# Altium schematic sheet LMR514203.3V.SchDoc
size A; SheetNumber: 9; SheetTotal: 16
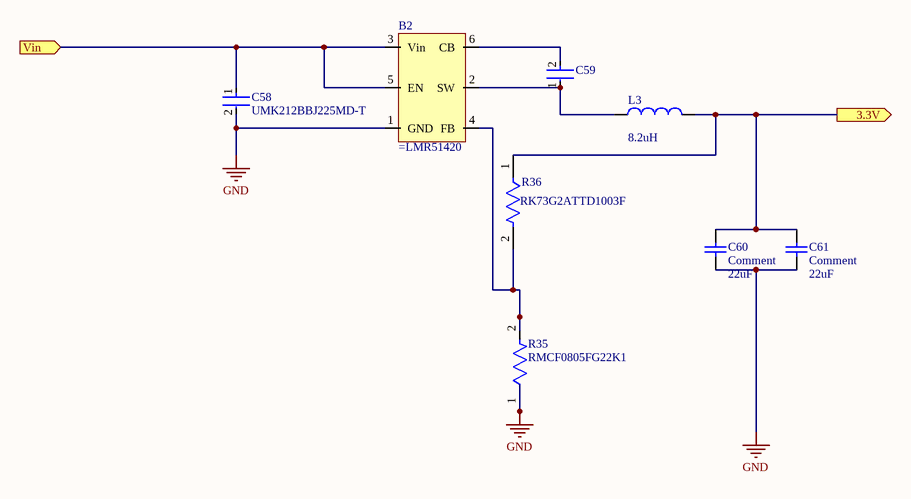
[diagram p0: LMR514203.3V.SchDoc]

## Parts
B2  (no value)  [PCBComponent_1]
C58  UMK212BBJ225MD-T  [FP-0805-L_2_0_0_2-W_1_25-IPC_A]
C59  C0603C104K4PAC7867  [FP-C0603C-CF-MFG]  (value not drawn)
C60  Comment  value 22uF  [Cap22uF_C1206C226M4PAC7800]
C61  Comment  value 22uF  [Cap22uF_C1206C226M4PAC7800]
L3  value 8.2uH  [0402-A]  (hidden comment: MSS1260H-822MED)
R35  RMCF0805FG22K1  [FP-RMCF0805-IPC_B]
R36  RK73G2ATTD1003F  [FP-RK73G2A-IPC_A]

## Ports
3.3V (out), Vin (in)

## Nets
GND: B2.1(GND) C58.2 C60.1 C61.1 R35.1
3.3V: C60.2 C61.2 L3.2 R36.1 ; port 3.3V
Vin: B2.3(Vin) B2.5(EN) C58.1 ; port Vin
NetB2_2: B2.2(SW) C59.1 L3.1
NetB2_4: B2.4(FB) R35.2 R36.2
NetB2_6: B2.6(CB) C59.2

## Library data of the parts
B2 = Component_1
C58 = CMP-14477-004278-2: Multilayer Ceramic Capacitor 2.2uF 50V X5R 20% SMD 0803 T/R; Max Operating Temperature: 85°C; Tolerance: 20%; Case Code (Imperial): 0805; Case/Package: 0805; Case Code (Metric): 2012; Capacitance: 2.2uF; Min Operating Temperature: -55°C; Mount: Surface Mount; Voltage Rating: 50V; Packaging: Tape and Reel; RoHS Compliant: Yes
C59 = CMP-03020-002384-2: CAP CER 0.1UF 16V X5R 0603; Manufacturer: KEMET; Automotive Grade: Grade 1; Value: 0.10 μF; Material: Ceramic; Temperature Coefficient: 30ppm/°C; Tolerance: 0.1; Manufacturer Part Number: C0603C104K4PAC7867; Automotive: Yes; Octopart: https://octopart.com/c0603c104k4pactu-kemet-12592163; Device Class L2: Capacitors; ComponentLink2URL: https://api.kemet.com/component-edge/download/datasheet/C0603C100J5GACAUTO.pdf; RoHS: TRUE; Height: 0.87mm; Temperature Characteristic: X5R; Voltage Rating: 16 V; Device Class L1: Passive Components; Category: Cap; Digikey Description: CAP CER 0.1UF 16V X5R 0603; Temperature Range High: +125°C; Package: C0603C-CF; Device Class L3: Ceramic Capacitors; Lead Free: Yes; Temperature: -55°C to +125°C; Temperature Range Low: -55°C; Capacitance: 0.10 μF; ComponentLink2Description: Datasheet
C60 C61 = Cap: Capacitor; Published: 8-Jun-2000; LatestRevisionDate: 17-Jul-2002; LatestRevisionNote: Re-released for DXP Platform.; PackageReference: RAD-0.3; Publisher: Altium Limited; PackageDescription: Radial Cap, Thru-Hole; 2 Leads; 0.3 in Pin Spacing
L3 = Inductor: Code_IEC: 1005; Published: 8-Jun-2000; LatestRevisionDate: 29-May-2009; LatestRevisionNote: IPC-7351 Footprint Added.; PackageReference: 0402-A; Publisher: Altium Limited; PackageDescription: Chip Inductor; Code_JEITA: 0402
R35 = CMP-26527-006791-1: 22.1kΩ ±1% 0.125W 0805 Thick Film Chip Resistor AEC-Q200 compliant; Max Power Dissipation: 125mW; Temperature Coefficient: 100ppm/°C; Resistance: 22.1kR; Max Operating Temperature: 155°C; Length: 0.079inch; Series: RMCF; RoHS Compliant: Yes; Number of Terminations: 2; Contact Plating: Tin; Width: 0.049inch; Package Quantity: 10000; Radiation Hardening: No; Height: 0.026inch; Features: Automotive AEC-Q200; Lead Free: Lead Free; Case Code (Imperial): 0805; Packaging: Tape and Reel; Mount: Surface Mount; Case/Package: 0805; Resistor Type: Thick Film; Case Code (Metric): 2012; Min Operating Temperature: -55°C; Tolerance: 1%
R36 = CMP-04015-080178-1: 100kΩ ±1% 0.125W Chip Resistor 0805 Thick Film AEC-Q200 Qualified; Voltage Rating: 150V; Power Rating: 125mW; Temperature Coefficient: 50ppm/°C; Resistance: 100kR; Series: RK73G; Termination: SMD/SMT; Packaging: Tape and Reel; Tolerance: 1%; Case Code (Imperial): 0805; RoHS Compliant: Yes; Max Operating Temperature: 125°C; Min Operating Temperature: -55°C; Case Code (Metric): 2012